# Altium schematic sheet Digital Input (DIN).SchDoc
size A4; SheetNumber: 5; SheetTotal: 10
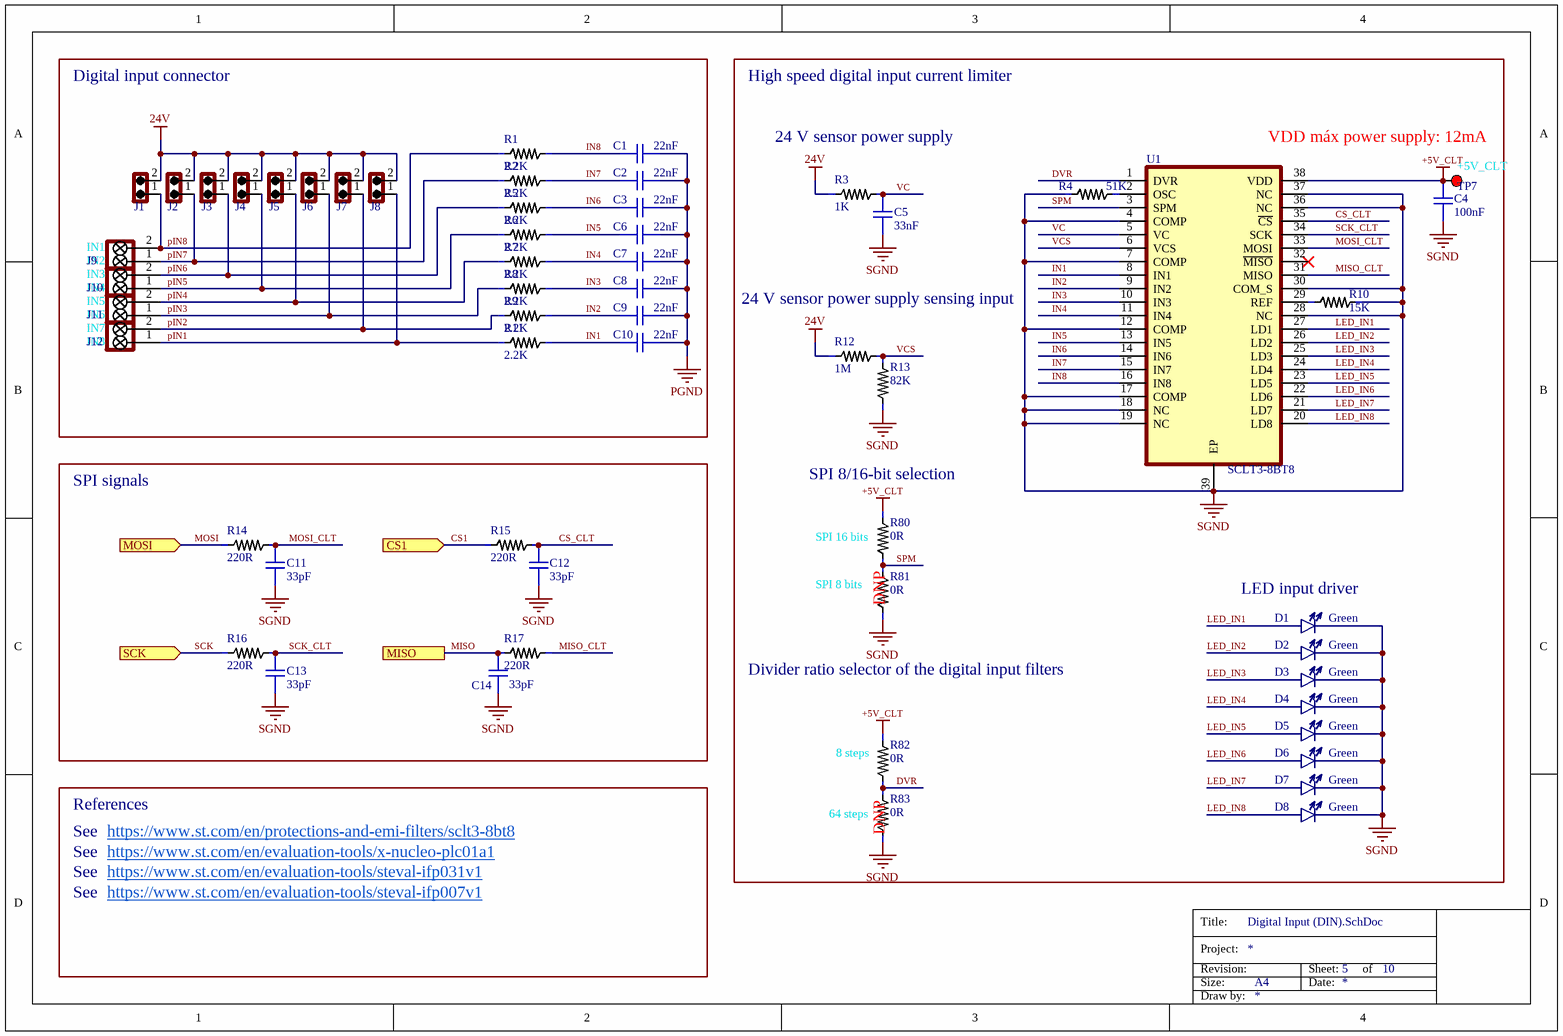
[diagram p0: Digital Input (DIN).SchDoc]

## Parts
C1  value 22nF  [CAPC2012N]  (hidden comment: Multilayer Ceramic Capacitors)
C2  value 22nF  [CAPC2012N]  (hidden comment: Multilayer Ceramic Capacitors)
C3  value 22nF  [CAPC2012N]  (hidden comment: Multilayer Ceramic Capacitors)
C4  value 100nF  [CAPC1005N]  (hidden comment: Multilayer Ceramic Capacitors)
C5  value 33nF  [CAPC2012N]  (hidden comment: Multilayer Ceramic Capacitors)
C6  value 22nF  [CAPC2012N]  (hidden comment: Multilayer Ceramic Capacitors)
C7  value 22nF  [CAPC2012N]  (hidden comment: Multilayer Ceramic Capacitors)
C8  value 22nF  [CAPC2012N]  (hidden comment: Multilayer Ceramic Capacitors)
C9  value 22nF  [CAPC2012N]  (hidden comment: Multilayer Ceramic Capacitors)
C10  value 22nF  [CAPC2012N]  (hidden comment: Multilayer Ceramic Capacitors)
C11  value 33pF  [CAPC1005N]  (hidden comment: Multilayer Ceramic Capacitors)
C12  value 33pF  [CAPC1005N]  (hidden comment: Multilayer Ceramic Capacitors)
C13  value 33pF  [CAPC1005N]  (hidden comment: Multilayer Ceramic Capacitors)
C14  value 33pF  [CAPC1005N]  (hidden comment: Multilayer Ceramic Capacitors)
D1  value Green  [LEDC1608X80N_GREEN]  (hidden comment: Single Color LED)
D2  value Green  [LEDC1608X80N_GREEN]  (hidden comment: Single Color LED)
D3  value Green  [LEDC1608X80N_GREEN]  (hidden comment: Single Color LED)
D4  value Green  [LEDC1608X80N_GREEN]  (hidden comment: Single Color LED)
D5  value Green  [LEDC1608X80N_GREEN]  (hidden comment: Single Color LED)
D6  value Green  [LEDC1608X80N_GREEN]  (hidden comment: Single Color LED)
D7  value Green  [LEDC1608X80N_GREEN]  (hidden comment: Single Color LED)
D8  value Green  [LEDC1608X80N_GREEN]  (hidden comment: Single Color LED)
J1  Male straight header  [CONH_ML254P-2N]  (value not drawn)
J2  Male straight header  [CONH_ML254P-2N]  (value not drawn)
J3  Male straight header  [CONH_ML254P-2N]  (value not drawn)
J4  Male straight header  [CONH_ML254P-2N]  (value not drawn)
J5  Male straight header  [CONH_ML254P-2N]  (value not drawn)
J6  Male straight header  [CONH_ML254P-2N]  (value not drawn)
J7  Male straight header  [CONH_ML254P-2N]  (value not drawn)
J8  Male straight header  [CONH_ML254P-2N]  (value not drawn)
J9  Terminal Blocks  [CONB_FIX508P-2N]  (value not drawn)
J10  Terminal Blocks  [CONB_FIX508P-2N]  (value not drawn)
J11  Terminal Blocks  [CONB_FIX508P-2N]  (value not drawn)
J12  Terminal Blocks  [CONB_FIX508P-2N]  (value not drawn)
R1  value 2.2K  [RESC2012N]  (hidden comment: Thick Film Resistors)
R2  value 2.2K  [RESC2012N]  (hidden comment: Thick Film Resistors)
R3  value 1K  [RESC2012N]  (hidden comment: Thick Film Resistors)
R4  value 51K  [RESC1005N]  (hidden comment: Thick Film Resistors)
R5  value 2.2K  [RESC2012N]  (hidden comment: Thick Film Resistors)
R6  value 2.2K  [RESC2012N]  (hidden comment: Thick Film Resistors)
R7  value 2.2K  [RESC2012N]  (hidden comment: Thick Film Resistors)
R8  value 2.2K  [RESC2012N]  (hidden comment: Thick Film Resistors)
R9  value 2.2K  [RESC2012N]  (hidden comment: Thick Film Resistors)
R10  value 15K  [RESC1005N]  (hidden comment: Thick Film Resistors)
R11  value 2.2K  [RESC2012N]  (hidden comment: Thick Film Resistors)
R12  value 1M  [RESC2012N]  (hidden comment: Thick Film Resistors)
R13  value 82K  [RESC2012N]  (hidden comment: Thick Film Resistors)
R14  value 220R  [RESC1005N]  (hidden comment: Thick Film Resistors)
R15  value 220R  [RESC1005N]  (hidden comment: Thick Film Resistors)
R16  value 220R  [RESC1005N]  (hidden comment: Thick Film Resistors)
R17  value 220R  [RESC1005N]  (hidden comment: Thick Film Resistors)
R80  value 0R  [RESC1005N]  (hidden comment: Thick Film Resistors)
R81  value 0R  [RESC1005N]  (hidden comment: Thick Film Resistors)  (no BOM)
R82  value 0R  [RESC1005N]  (hidden comment: Thick Film Resistors)
R83  value 0R  [RESC1005N]  (hidden comment: Thick Film Resistors)  (no BOM)
TP7  Test point  [TP-1MM]  (value not drawn)  (no BOM)
U1  Part Number: SCLT3-8BT8  [SOP50P640X110-39N]  (hidden comment: I/O Controller Interface)

## Blocks framed on the sheet
Digital input connector: C1-C3 C6-C10 J1-J12 R1 R2 R5-R9 R11
SPI signals: C11-C14 R14-R17

## Ports
CS1 (in, see Main[3C], Microcontroller (MCU)[4C]), MISO (see Main[3C], Digital Output (DOUT)[1C], Microcontroller (MCU)[4C]), MOSI (in, see Main[3B], Digital Output (DOUT)[1C], Microcontroller (MCU)[4C]), SCK (in, see Main[3C], Digital Output (DOUT)[1C], Microcontroller (MCU)[4C])

## Nets
24V: J1.2 J2.2 J3.2 J4.2 J5.2 J6.2 J7.2 J8.2 R3.1 R12.1
+5V_CLT: C4.1 R80.2 R82.2 TP7.1 U1.38(VDD)
PGND: C1.2 C2.2 C3.2 C6.2 C7.2 C8.2 C9.2 C10.2
SGND: C4.2 C5.2 C11.2 C12.2 C13.2 C14.2 D1.C D2.C D3.C D4.C D5.C D6.C D7.C D8.C R4.1 R10.2 R13.1 R81.1 R83.1 U1.4(COMP) U1.7(COMP) U1.12(COMP) U1.17(COMP) U1.18(NC) U1.19(NC) U1.28(NC) U1.30(COM_S) U1.36(NC) U1.37(NC) U1.39(EP)
CS1: R15.1 ; port CS1
CS_CLT: C12.1 R15.2 U1.35(~{CS})
DVR: R82.1 R83.2 U1.1(DVR)
IN1: C10.1 R11.2 U1.8(IN1)
IN2: C9.1 R9.2 U1.9(IN2)
IN3: C8.1 R8.2 U1.10(IN3)
IN4: C7.1 R7.2 U1.11(IN4)
IN5: C6.1 R6.2 U1.13(IN5)
IN6: C3.1 R5.2 U1.14(IN6)
IN7: C2.1 R2.2 U1.15(IN7)
IN8: C1.1 R1.2 U1.16(IN8)
LED_IN1: D1.A U1.27(LD1)
LED_IN2: D2.A U1.26(LD2)
LED_IN3: D3.A U1.25(LD3)
LED_IN4: D4.A U1.24(LD4)
LED_IN5: D5.A U1.23(LD5)
LED_IN6: D6.A U1.22(LD6)
LED_IN7: D7.A U1.21(LD7)
LED_IN8: D8.A U1.20(LD8)
MISO: C14.1 R17.1 ; port MISO
MISO_CLT: R17.2 U1.31(MISO)
MOSI: R14.1 ; port MOSI
MOSI_CLT: C11.1 R14.2 U1.33(MOSI)
pIN1: J8.1 J12.1 R11.1
pIN2: J7.1 J12.2 R9.1
pIN3: J6.1 J11.1 R8.1
pIN4: J5.1 J11.2 R7.1
pIN5: J4.1 J10.1 R6.1
pIN6: J3.1 J10.2 R5.1
pIN7: J2.1 J9.1 R2.1
pIN8: J1.1 J9.2 R1.1
SCK: R16.1 ; port SCK
SCK_CLT: C13.1 R16.2 U1.34(SCK)
SPM: R80.1 R81.2 U1.3(SPM)
VC: C5.1 R3.2 U1.5(VC)
VCS: R12.2 R13.2 U1.6(VCS)
NetR4_2: R4.2 U1.2(OSC)
NetR10_1: R10.1 U1.29(REF)

Not connected (* = marked no-connect by the designer): U1 32(~{MISO})*

## Notes on the sheet
- High speed digital input current limiter
- 24 V sensor power supply
- VDD máx power supply: 12mA
- (near TP7) +5V_CLT
- IN1
- IN2
- IN3
- IN4
- IN5
- 24 V sensor power supply sensing input
- IN6
- IN7
- IN8
- (near R80) SPI 8/16-bit selection
- (near R80) SPI 16 bits
- (near R81) SPI 8 bits
- (near R81) DNP
- (near D1) LED input driver
- Divider ratio selector of the digital input filters
- (near R82) 8 steps
- References
- See
- https://www.st.com/en/protections-and-emi-filters/sclt3-8bt8
- (near R83) 64 steps
- (near R83) DNP
- https://www.st.com/en/evaluation-tools/x-nucleo-plc01a1
- https://www.st.com/en/evaluation-tools/steval-ifp031v1
- https://www.st.com/en/evaluation-tools/steval-ifp007v1
- Title:
- Project:
- Revision:
- Size:
- A4
- Sheet:
- Date:
- of
- Draw by:

## Library data of the parts
C1-C3 C6-C10 = C-MLCC-22nF-100V-10%-0805: Multilayer Ceramic Capacitors MLCC - SMD/SMT 100 V 0.022 uF X7R 0805 10%; Part Number: CC0805KRX7R0BB223; Manufacturer: YAGEO; Mounting Type: SMT; Mouser Part #: 603-CC805KRX7R0BB223; Digikey Part #: 311-1473-1-ND; JLCPCB Part #: C107137
C4 = C-MLCC-100nF-50V-10%-0402: Multilayer Ceramic Capacitors MLCC - SMD/SMT 50 V 0.1uF X7R 0402 10%; Part Number: CC0402KRX5R9BB104; Manufacturer: YAGEO; Mounting Type: SMT; Mouser Part #: 603-CC402KRX5R9BB104; Digikey Part #: 311-3342-1-ND; JLCPCB Part #: C105882
C5 = C-MLCC-33nF-100V-10%-0805: Multilayer Ceramic Capacitors MLCC - SMD/SMT 100 V 0.033 uF X7R 0805 10%; Part Number: CC0805KKX7R0BB333; Manufacturer: YAGEO; Mounting Type: SMT; Mouser Part #: 603-CC805KKX7R0BB333; Digikey Part #: 311-1875-1-ND; JLCPCB Part #: C327114
C11-C14 = C-MLCC-33pF-50V-10%-0402: Multilayer Ceramic Capacitors MLCC - SMD/SMT 50 V 33 pF C0G 0402 1%; Part Number: CC0402KRNPO9BN330; Manufacturer: YAGEO; Mounting Type: SMT; Mouser Part #: 603-CC0402KRNP9BN330; Digikey Part #: 13-CC0402KRNPO9BN330CT-ND; JLCPCB Part #: C107005
D1-D8 = D-LED-GREEN-2V-20mA-0603: Standard Single Color LEDs 0603 Green; Part Number: LTST-C190KGKT; Manufacturer: LITEON; Mounting Type: SMT; Mouser Part #: 859-LTST-C190KGKT; Digikey Part #: 160-1435-1-ND; JLCPCB Part #: C125094
J1-J8 = J-02-2P54-HDR-M-VERT-TH: Male straight header, 1 row, 2 positions, 2.54mm pitch, through-hole; Part Number: 10129378-902001BLF; Manufacturer: Amphenol FCI; Mounting Type: THT; Mouser Part #: 649-1012937890201BLF; Digikey Part #: 10129378-902001BLF-ND; JLCPCB Part #: C3324910
J9-J12 = J-02-5P08-TERM-F-VERT-TH: Pluggable Terminal Blocks 2 Pos 5.08mm pitch Through Hole Header; Manufacturer: Adam Tech; Part Number: EBA-02-D-BU-01; Mouser Part #: 737-EBA-02-D-BU-01; Mounting Type: THT; Digikey Part #: ED2609-ND; JLCPCB Part #: C8475
R1 R2 R5-R9 R11 = R-THICK-2K2-125mW-1%-0805: Thick Film Resistors - SMD General Purpose Chip Resistor 0805, 2.2kOhms, 1%, 1/8W; Part Number: RC0805FR-072K2L; Manufacturer: YAGEO; Mounting Type: SMT; Mouser Part #: 603-RC0805FR-072K2L; Digikey Part #: 311-2.20KCRCT-ND; JLCPCB Part #: C114561
R3 = R-THICK-1K-125mW-1%-0805: Thick Film Resistors - SMD General Purpose Chip Resistor 0805, 1kOhms, 1%, 1/8W; Part Number: RC0805FR-071KL; Manufacturer: YAGEO; Mounting Type: SMT; Mouser Part #: 603-RC0805FR-071KL; Digikey Part #: 311-1.00KCRCT-ND; JLCPCB Part #: C95781
R4 = R-THICK-51K-62.5mW-1%-0402: Thick Film Resistors - SMD General Purpose Chip Resistor 0402, 51kOhms, 1%, 1/16W; Part Number: RC0402FR-0751KL; Manufacturer: YAGEO; Mounting Type: SMT; Mouser Part #: 603-RC0402FR-0751KL; Digikey Part #: 311-51.0KLRCT-ND; JLCPCB Part #: C107229
R10 = R-THICK-15K-62.5mW-1%-0402: Thick Film Resistors - SMD General Purpose Chip Resistor 0402, 15kOhms, 1%, 1/16W; Part Number: RC0402FR-0715KL; Manufacturer: YAGEO; Mounting Type: SMT; Mouser Part #: 603-RC0402FR-0715KL; Digikey Part #: 311-15.0KLRCT-ND; JLCPCB Part #: C114761
R12 = R-THICK-1M-125mW-1%-0805: Thick Film Resistors - SMD General Purpose Chip Resistor 0805, 1MOhms, 1%, 1/8W; Part Number: RC0805FR-071ML; Manufacturer: YAGEO; Mounting Type: SMT; Mouser Part #: 603-RC0805FR-071ML; Digikey Part #: 311-1.00MCRCT-ND; JLCPCB Part #: C107700
R13 = R-THICK-82K-125mW-1%-0805: Thick Film Resistors - SMD General Purpose Chip Resistor 0805, 82 kOhms, 1%, 1/8W; Part Number: RC0805FR-0782KL; Manufacturer: YAGEO; Mounting Type: SMT; Mouser Part #: 603-RC0805FR-0782KL; Digikey Part #: 311-82.0KCRCT-ND; JLCPCB Part #: C137489
R14-R17 = R-THICK-220R-62.5mW-1%-0402: Thick Film Resistors - SMD General Purpose Chip Resistor 0402, 220Ohms, 1%, 1/16W; Part Number: RC0402FR-07220RL; Manufacturer: YAGEO; Mounting Type: SMT; Mouser Part #: 603-RC0402FR-07220RL; Digikey Part #: 311-220LRCT-ND; JLCPCB Part #: C112291
R80-R83 = R-THICK-0R-62.5mW-1%-0402: Thick Film Resistors - SMD General Purpose Chip Resistor 0402, 0Ohms, 1%, 1/16W; Part Number: RC0402FR-070RL; Manufacturer: YAGEO; Mounting Type: SMT; Mouser Part #: 603-RC0402FR-070RL; Digikey Part #: 311-0.0LRCT-ND; JLCPCB Part #: C106231
TP7 = TP-1MM-SMD: Test point, 1mm, exposed pad; Mounting Type: SMD; JLCPCB Part #: C5199810
U1 = U-SCLT3-8BT8: I/O Controller Interface IC 8-Line Protected Digital Serial; Manufacturer: STMicroelectronics; Mounting Type: SMT; Mouser Part #: 511-SCLT3-8BT8; Digikey Part #: 497-10100-5-ND; JLCPCB Part #: C1519056